# EAGLE design Ilumitunes-Master-Controller-v11 (EAGLE 6.1)
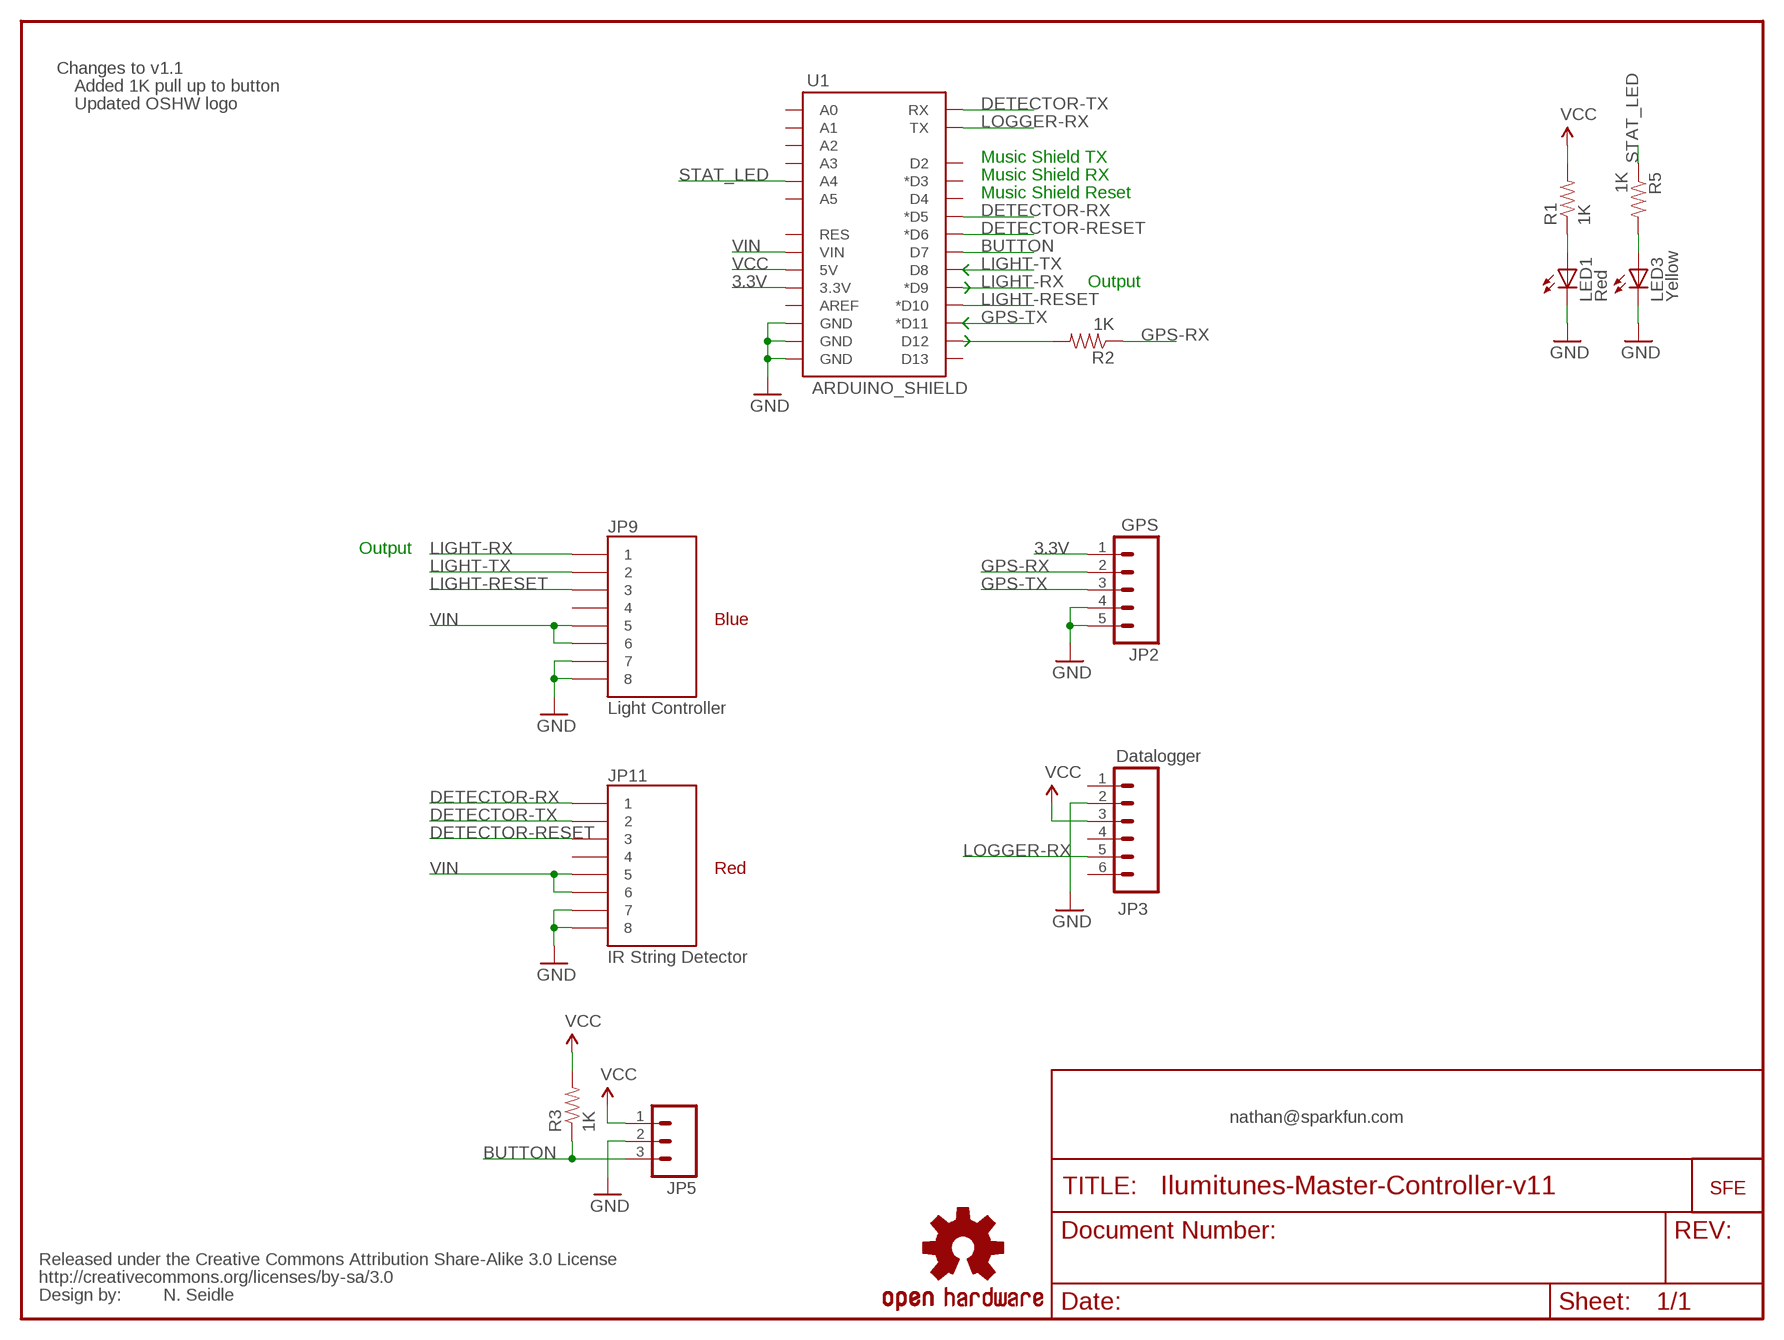
[diagram p0: schematic, sheet 1]

## Parts
JP2  GPS  M05PTH  [1X05]
JP3  Datalogger  M06SIP  [1X06]
JP5  M03JST-PTH-VERT  [JST-3-PTH-VERT]
JP9  Light Controller  RJ45-8PTH  [RJ45-8]
JP11  IR String Detector  RJ45-8PTH  [RJ45-8]
LED1  Red  LED5MM  [LED5MM]
LED3  Yellow  LED5MM  [LED5MM]
R1  1K  RESISTORAXIAL-0.3  [AXIAL-0.3]
R2  1K  RESISTORAXIAL-0.3  [AXIAL-0.3]
R3  1K  RESISTORAXIAL-0.3  [AXIAL-0.3]
R5  1K  RESISTORAXIAL-0.3  [AXIAL-0.3]
U1  ARDUINO_SHIELD  ARDUINO_SHIELDLABEL  [DUEMILANOVE_SHIELD]
U$1  LOGO-SFENEW  [SFE-NEW-WEBLOGO]
U$2  CREATIVE_COMMONS  [CREATIVE_COMMONS]
U$3  OSHW-LOGOS  [OSHW-LOGO-S]

## Nets
3.3V: JP2.1 U1.3.3V
BUTTON: JP5.3 R3.P$1 U1.D7
DETECTOR-RESET: JP11.3 U1.D6(*D6)
DETECTOR-RX: JP11.1 U1.D5(*D5)
DETECTOR-TX: JP11.2 U1.RX
GND: JP2.4 JP2.5 JP3.2 JP5.2 JP9.7 JP9.8 JP11.7 JP11.8 LED1.K(C) LED3.K(C) U1.GND@0(GND) U1.GND@1(GND) U1.GND@2(GND)
GPS-RX: JP2.2 R2.P$1
GPS-TX: JP2.3 U1.D11(*D11)
LIGHT-RESET: JP9.3 U1.D10(*D10)
LIGHT-RX: JP9.1 U1.D9(*D9)
LIGHT-TX: JP9.2 U1.D8
LOGGER-RX: JP3.5 U1.TX
N$1: LED1.A R1.P$1
N$3: R2.P$2 U1.D12
N$4: LED3.A R5.P$2
STAT_LED: R5.P$1 U1.A4
VCC [vcc]: JP3.3 JP5.1 R1.P$2 R3.P$2 U1.5V
VIN: JP9.5 JP9.6 JP11.5 JP11.6 U1.VIN
Unconnected: JP3.1 JP3.4 JP3.6 JP9.4 JP11.4 U1.A0 U1.A1 U1.A2 U1.A3 U1.A5 U1.AREF U1.D2 U1.D3(*D3) U1.D4 U1.D13 U1.RES

## Notes on the sheet
- Changes to v1.1
- Added 1K pull up to button
- Updated OSHW logo
- Music Shield TX
- Music Shield RX
- Music Shield Reset
- Output
- Output
- Blue
- Red
- nathan@sparkfun.com
- N. Seidle

## Library data of the parts
JP2 = SparkFun:M05: Header 5 Standard 5-pin 0.1" header. Use with straight break away headers (SKU : PRT-00116), right angle break away headers (PRT-00553), swiss pins (PRT-00743), machine pins (PRT-00117), and female headers (PRT-00115). Molex polarized connector foot print use with SKU : PRT-08230 with associated crimp pins and housings.
JP3 = SparkFun:M06: Header 6 Standard 6-pin 0.1" header. Use with straight break away headers (SKU : PRT-00116), right angle break away headers (PRT-00553), swiss pins (PRT-00743), machine pins (PRT-00117), and female headers (PRT-00115). Molex polarized connector foot print use with SKU : PRT-08094 with associated crimp pins and housings. NOTES ON THE VARIANTS LOCK and LOCK_LONGPADS... This footprint was designed to help hold the alignment of a through-hole component (i.e. 6-pin header) while soldering it into place. You may notice that each hole has been shifted either up or down by 0.005 of an inch from it's more standard position (which is a perfectly straight line). This slight alteration caused the pins (the squares in the middle) to touch the edges of the holes. Because they are alternating, it causes a "brace" to hold the component in place. 0.005 has proven to be the perfect amount of "off-center" position when using our standard breakaway headers. Although looks a little odd when you look at the bare footprint, once you have a header in there, the alteration is very hard to notice. Also, if you push a header all the way into place, it is covered up entirely on the bottom side. This idea of altering the position of holes to aid alignment will be further integrated into the Sparkfun Library for other footprints. It can help hold any component with 3 or more connection pins.
JP5 = SparkFun:M03: Header 3 Standard 3-pin 0.1" header. Use with straight break away headers (SKU : PRT-00116), right angle break away headers (PRT-00553), swiss pins (PRT-00743), machine pins (PRT-00117), and female headers (PRT-00115). Molex polarized connector foot print use with SKU : PRT-08232 with associated crimp pins and housings.
JP9 JP11 = SparkFun:RJ45-8: RJ45 Jack Simple RJ45, 8-pin connection - connector for common Cat5, Cat5e, and Cat6 Ethernet cables. Footprint not yet proven in production. Connector sku is PRT-00643; Breakout PCB sku is BOB-00716.
LED1 LED3 = SparkFun:LED: LEDs Standard schematic elements and footprints for 5mm, 3mm, 1206, and 0603 sized LEDs. 5mm - Spark Fun Electronics SKU : COM-00529 (and others)
R1 R2 R5 = SparkFun:RESISTOR: Resistor Basic schematic elements and footprints for 0603, 1206, and PTH resistors.
R3 = SparkFun-Passives:RESISTOR: Resistor Basic schematic elements and footprints for 0603, 1206, and PTH resistors.
U1 = SparkFun:ARDUINO_SHIELD
U$1 = SparkFun:LOGO-SFE: Spark Fun Electronics PCB Logo This is the standard Spark Fun Electronics PCB logo.
U$2 = SparkFun-Aesthetics:CREATIVE_COMMONS: Creative Commons License summary
U$3 = SparkFun-Aesthetics:OSHW-LOGO: Open Source Hardware Logo This logo indicates the piece of hardware it is found on incorporates a OSHW license and/or adheres to the definition of open source hardware found here: http://freedomdefined.org/OSHW

## Net classes
1 vcc: width 0.254 mm

## Board
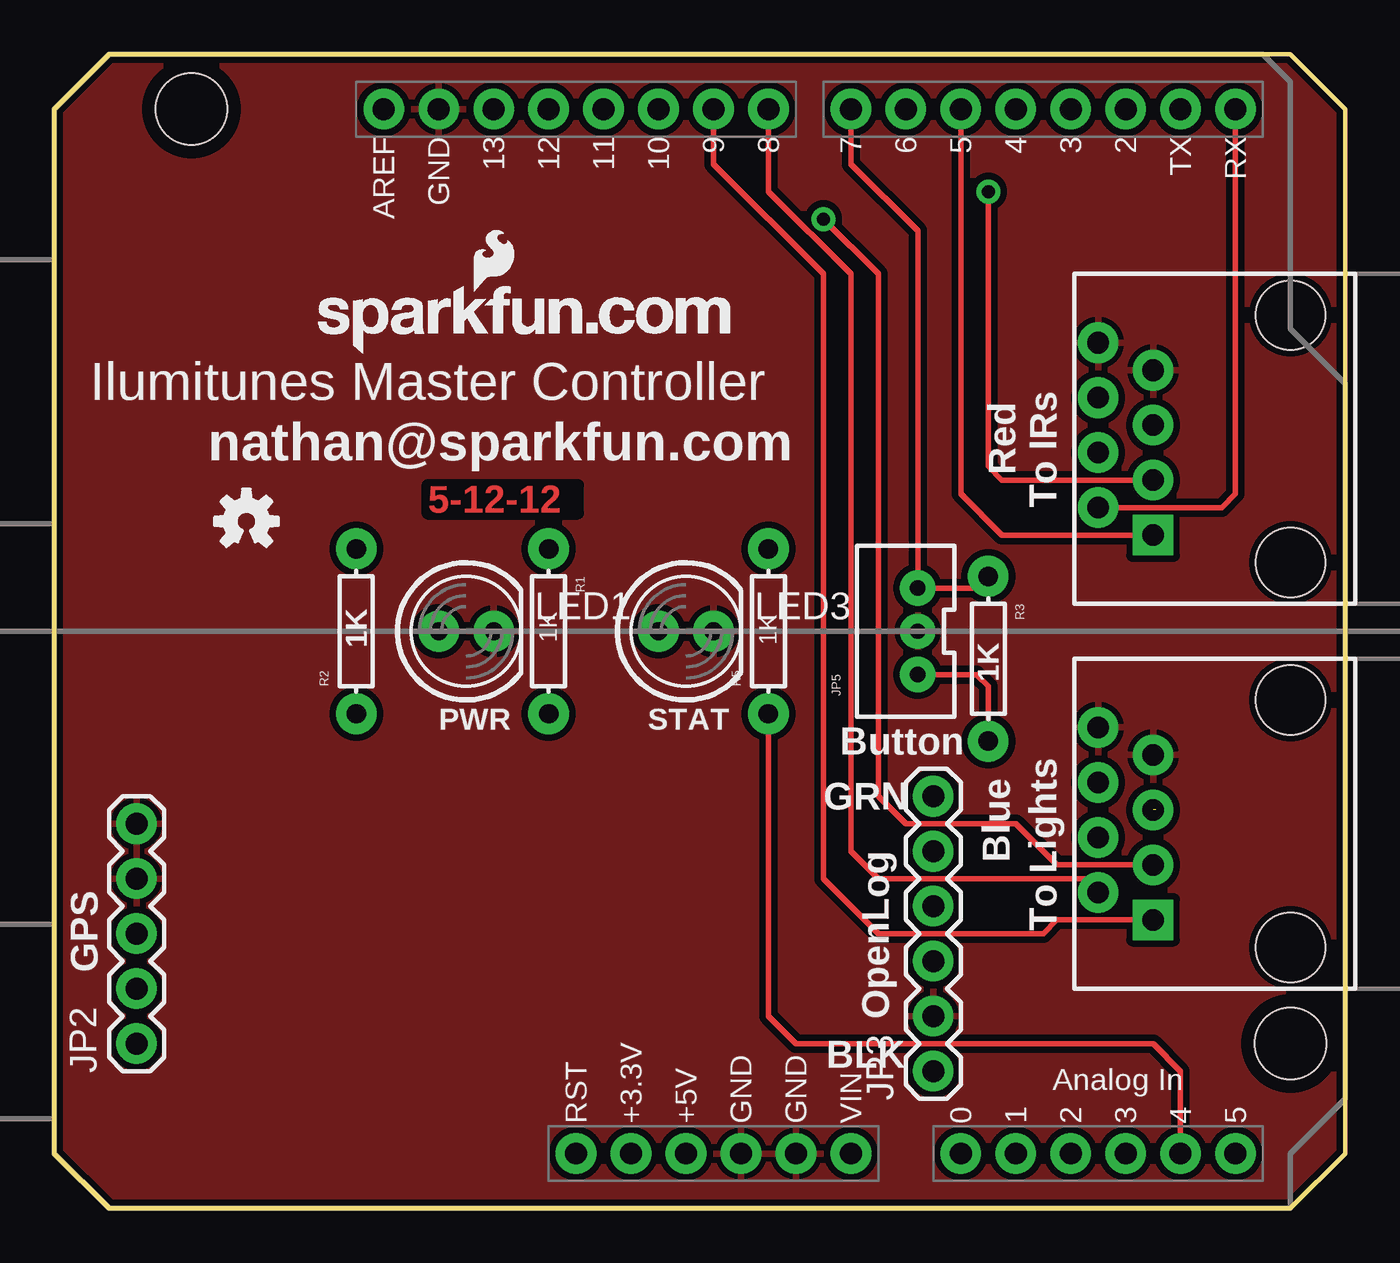
[diagram p1: board, top side]
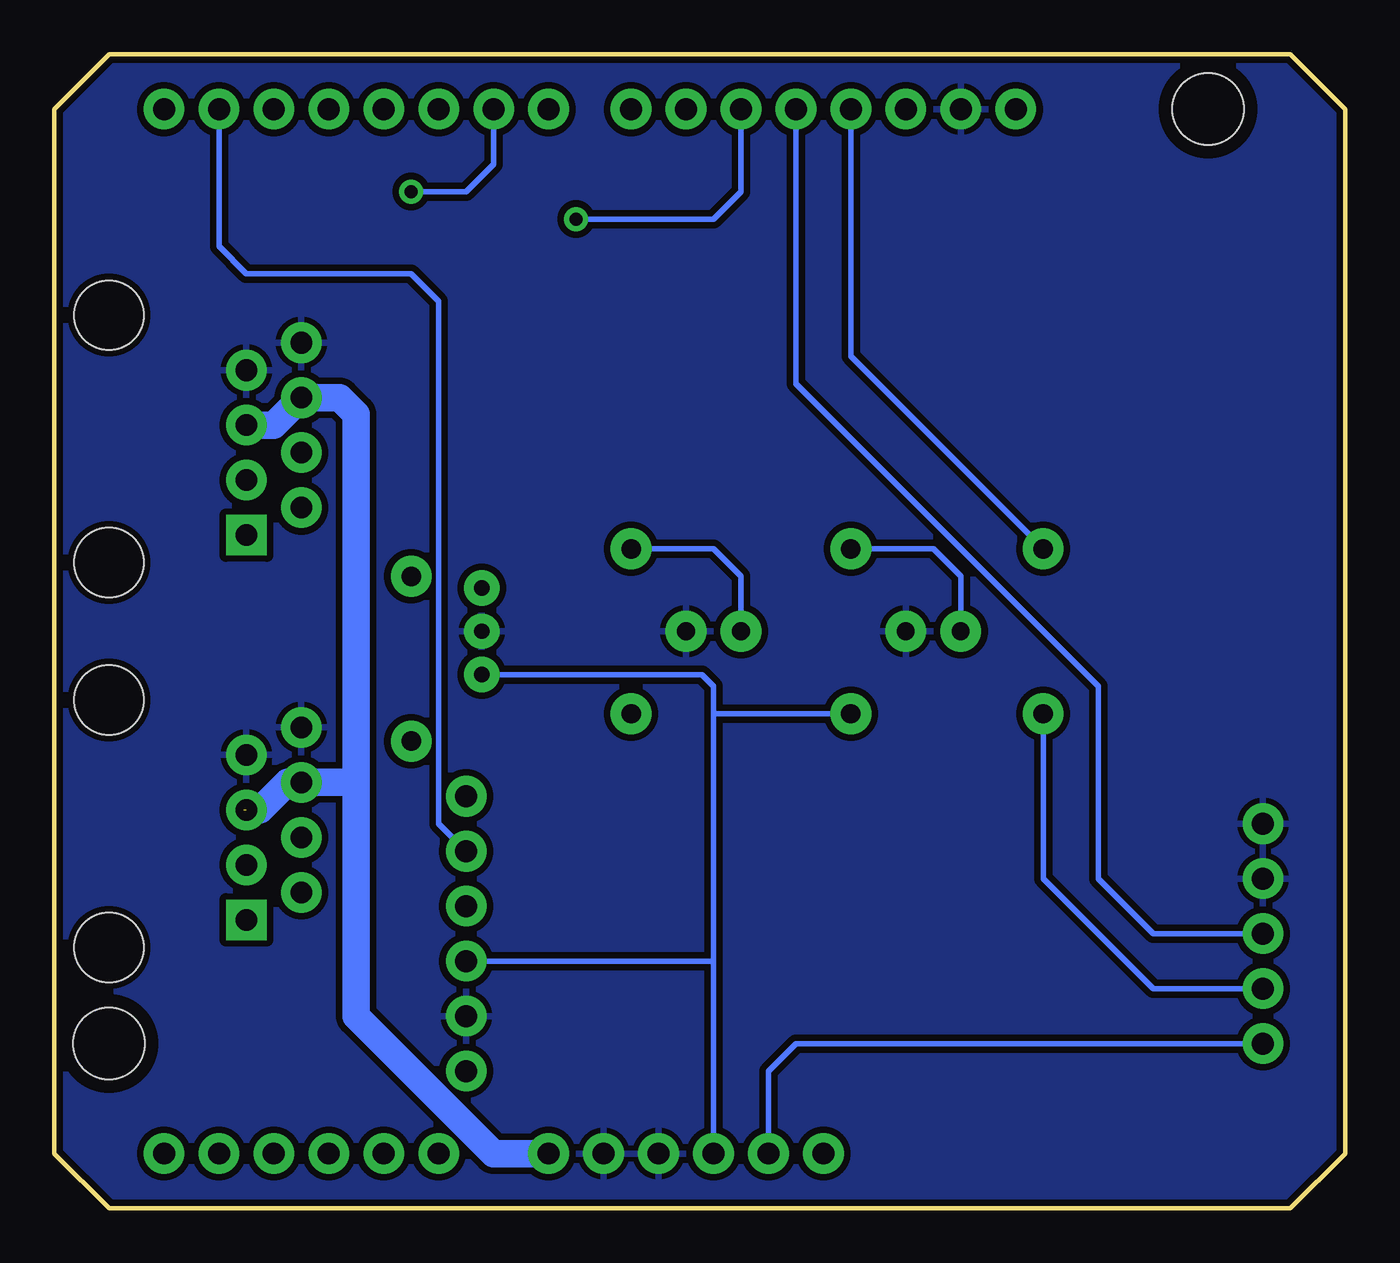
[diagram p2: board, bottom side, seen from below]

Size 59.69 x 53.34 mm. Coordinates in mm from the lower left corner, seen from the top.
Outline: 2.54,0 57.15,0 59.69,2.54 59.69,50.8 57.15,53.34 2.54,53.34 0,50.8 0,2.54 2.54,0
Copper layers (1*16): Top 0.035mm / dielectric 1.5mm / Bottom 0.035mm
Design rules: minimum track width 10mil, minimum drill 20mil, track to track 8mil, track to pad 8mil, pad to pad 8mil, via to via 8mil, smd to smd 8mil, copper to edge 10mil, drill to drill 8mil, minimum pad ring 12mil, minimum via ring 10mil, stop-mask expansion 4mil, vias tented up to drill 25mil, thermal gap 10mil

### Footprints (pad centres in the part's own frame; a part is rotated, then mirrored left to right if it is on the bottom)
1X05 = drill 1.016 pad 1.88: 1 0,0; 2 2.54,0; 3 5.08,0; 4 7.62,0; 5 10.16,0
1X06 = drill 1.016 pad 1.88: 1 0,0; 2 2.54,0; 3 5.08,0; 4 7.62,0; 5 10.16,0; 6 12.7,0
JST-3-PTH-VERT = drill 0.7 pad 1.626: 1 -2,-0.55; 2 0,-0.55; 3 2,-0.55
RJ45-8 = drill 1 pad 1.88 square: 1 -4.445,6.35 | drill 1 pad 1.88: 2 -3.175,8.89; 3 -1.905,6.35; 4 -0.635,8.89; 5 0.635,6.35; 6 1.905,8.89; 7 3.175,6.35; 8 4.445,8.89 | hole 3.2: -5.715,0; 5.715,0
LED5MM = drill 0.813 pad 1.88: A -1.27,0; K 1.27,0
AXIAL-0.3 = drill 0.9 pad 1.88: P$1 -3.81,0; P$2 3.81,0
DUEMILANOVE_SHIELD = drill 1.016 pad 1.88: 3.3V 50.8,26.67; 5V 50.8,29.21; A0 50.8,41.91; A1 50.8,44.45; A2 50.8,46.99; A3 50.8,49.53; A4 50.8,52.07; A5 50.8,54.61; AREF 2.54,15.24; D2 2.54,49.53; D3 2.54,46.99; D4 2.54,44.45; D5 2.54,41.91; D6 2.54,39.37; D7 2.54,36.83; D8 2.54,33.02; D9 2.54,30.48; D10 2.54,27.94; D11 2.54,25.4; D12 2.54,22.86; D13 2.54,20.32; GND@0 50.8,31.75; GND@1 50.8,34.29; GND@2 2.54,17.78; RES 50.8,24.13; RX 2.54,54.61; TX 2.54,52.07; VIN 50.8,36.83 | hole 3.302: 45.72,57.15; 2.54,6.35

### Placement (x,y rotation side)
JP2  3.81,7.62 90 top
JP3  40.64,6.35 90 top
JP5  39.37,26.67 90 top
JP9  57.15,17.78 90 top
JP11  57.15,35.56 90 top
LED1  19.05,26.67 0 top
LED3  29.21,26.67 0 top
R1  22.86,26.67 270 top
R2  13.97,26.67 90 top
R3  43.18,25.4 270 top
R5  33.02,26.67 90 top
U1  0,53.34 270 top
U$1  12.19,39.5 0 top
U$2  6.35,-17.78 0 top  (outside the outline)
U$3  8.89,31.75 0 top

### Tracks (layer width: path | path; a pad name or v marks a point on that pad's centre or on a via)
3.3V
  Bottom 0.254: JP2.1 25.4,7.62 26.67,6.35 U1.3.3V
BUTTON
  Top 0.254: U1.D7 36.83,48.26 39.92,45.17 JP5.3 42.64,28.67 R3.P$1
DETECTOR-RESET  (via drill 0.6)
  Top 0.254: JP11.3 43.81,33.66 43.18,34.29 v43.18,46.99
  Bottom 0.254: v43.18,46.99 40.64,46.99 39.37,48.26 U1.D6
DETECTOR-RX
  Top 0.254: JP11.1 43.81,31.11 41.91,33.02 U1.D5
DETECTOR-TX
  Top 0.254: JP11.2 53.98,32.38 54.61,33.02 U1.RX
GND
  pour Top (isolate 0.305): 0,0 0,53.34 59.69,53.34 59.69,0
  pour Bottom (isolate 0.305): 0,0 0,53.34 59.69,53.34 59.69,0
GPS-RX
  Bottom 0.254: JP2.2 8.89,10.16 13.97,15.24 R2.P$1
GPS-TX
  Bottom 0.254: U1.D11 25.4,38.1 11.43,24.13 11.43,15.24 8.89,12.7 JP2.3
LIGHT-RESET  (via drill 0.6)
  Top 0.254: JP9.3 46.35,15.88 44.45,17.78 39.37,17.78 38.1,19.05 38.1,43.18 v35.56,45.72
  Bottom 0.254: v35.56,45.72 29.21,45.72 27.94,46.99 U1.D10
LIGHT-RX
  Top 0.254: JP9.1 46.35,13.34 45.72,12.7 38.1,12.7 35.56,15.24 35.56,43.18 30.48,48.26 U1.D9
LIGHT-TX
  Top 0.254: JP9.2 47.62,15.24 38.1,15.24 36.83,16.51 36.83,43.18 33.02,46.99 U1.D8
LOGGER-RX
  Bottom 0.254: U1.TX 52.07,44.45 50.8,43.18 43.18,43.18 41.91,41.91 41.91,17.78 JP3.5
N$1
  Bottom 0.254: LED1.A 17.78,29.21 19.05,30.48 R1.P$1
N$3
  Bottom 0.254: R2.P$2 22.86,39.37 U1.D12
N$4
  Bottom 0.254: LED3.A 27.94,29.21 29.21,30.48 R5.P$2
STAT_LED
  Top 0.254: R5.P$1 33.02,8.89 34.29,7.62 50.8,7.62 52.07,6.35 U1.A4
VCC
  Top 0.254: JP5.1 42.64,24.67 43.18,24.13 R3.P$2
  Bottom 0.254: JP5.1 29.75,24.67 29.21,24.13 29.21,22.86 | U1.5V 29.21,11.43 | 29.21,11.43 29.21,22.86 | 29.21,22.86 R1.P$2 | 29.21,11.43 JP3.3
VIN  (1 unrouted)
  Bottom 1.27: U1.VIN 39.37,2.54 45.72,8.89 45.72,19.68 | 50.93,18.41 50.16,18.41 48.9,19.68 JP9.6 45.72,19.68 | JP11.5 49.53,36.2 JP11.6 46.48,37.47 45.72,36.7 45.72,19.68

### Text on the board
Top: 5-12-12
tPlace: Ilumitunes Master Controller | nathan@sparkfun.com | Red | To IRs | PWR | STAT | Button | GRN | Blue | To Lights | GPS | OpenLog | BLK